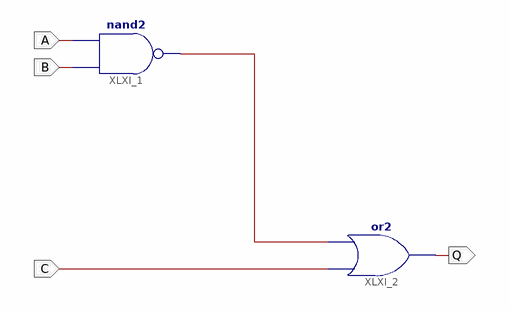
[diagram p0: schematic sheet 1]
// Xilinx ISE schematic example1.sch (spartan3e) as structural Verilog: 2 symbols, 4 ports
module example1 (
  input  A,
  input  B,
  input  C,
  output Q
);

  wire XLXN_5;

  nand XLXI_1 (XLXN_5, B, A);
  or XLXI_2 (Q, C, XLXN_5);
endmodule
